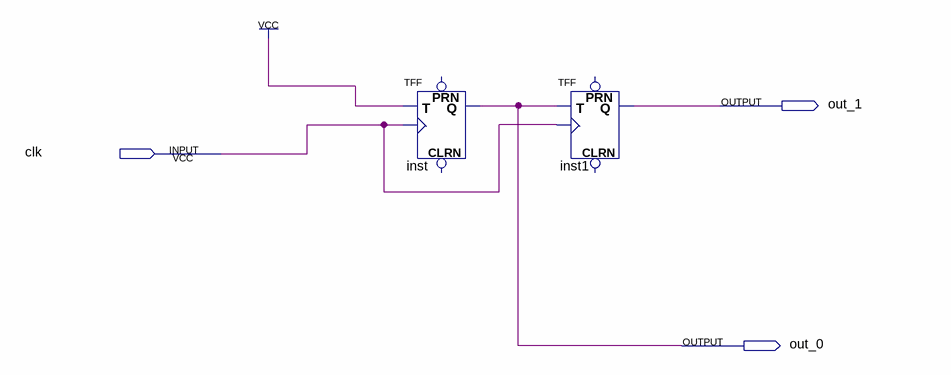
[diagram p0: schematic sheet]
// Quartus schematic counter.bdf as structural Verilog: 2 symbols, 3 pins
module counter (
  input  clk,
  output out_1,
  output out_0
);

  TFF inst (.T(1'b1), .CLK(clk), .Q(out_0));  // open: PRN, CLRN
  TFF inst1 (.T(out_0), .CLK(clk), .Q(out_1));  // open: PRN, CLRN
endmodule
